# Altium schematic sheet Gamepad_IO.SchDoc
size A; SheetNumber: 2; SheetTotal: 4
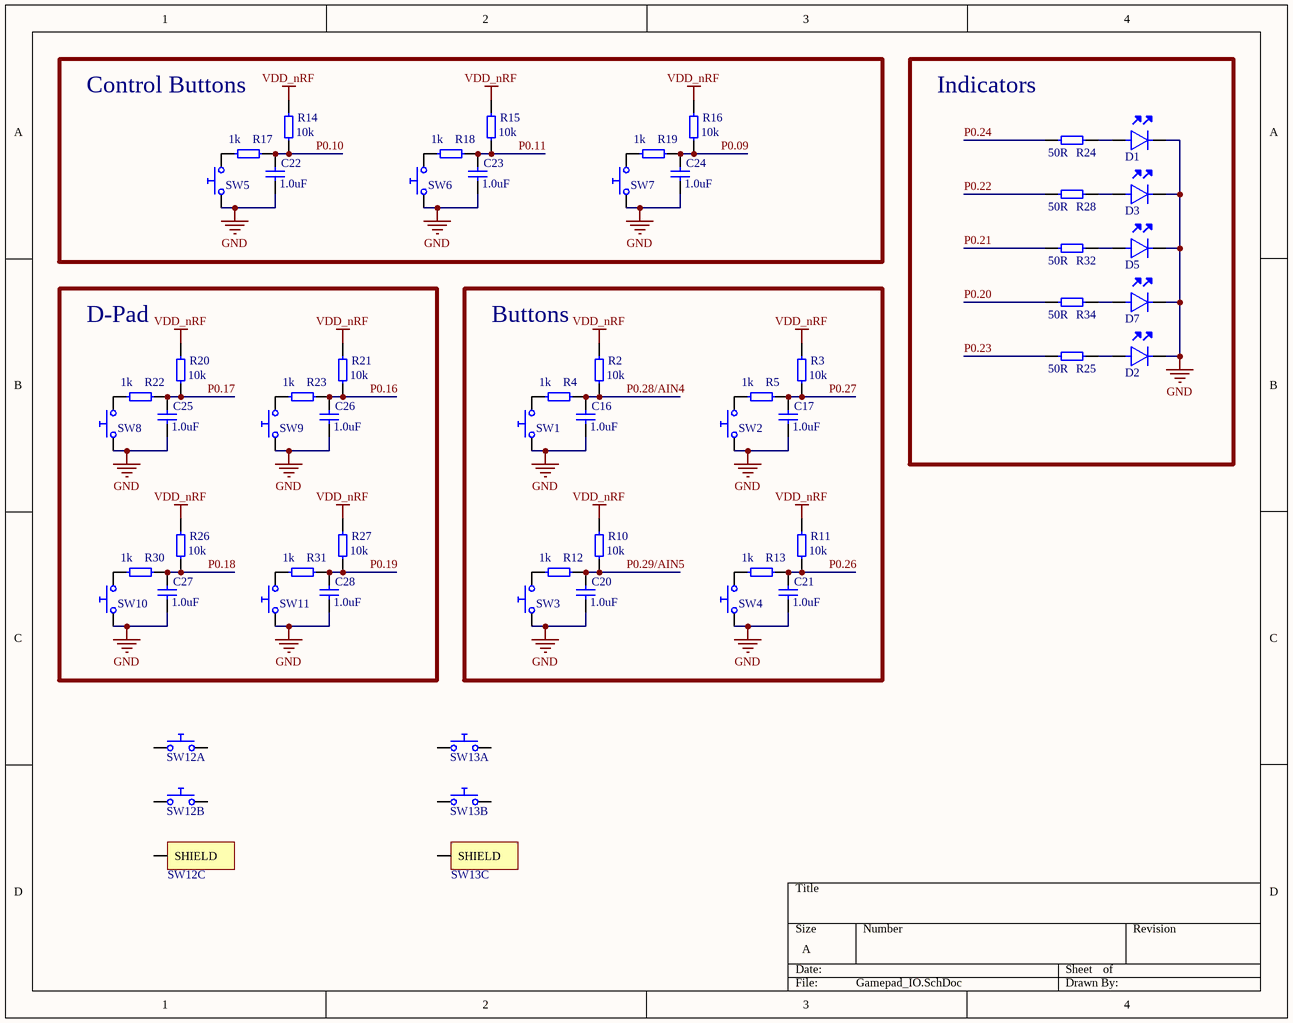
[diagram p0: Gamepad_IO.SchDoc]

## Parts
C16  1.0uF  [0603 Capacitor]
C17  1.0uF  [0603 Capacitor]
C20  1.0uF  [0603 Capacitor]
C21  1.0uF  [0603 Capacitor]
C22  1.0uF  [0603 Capacitor]
C23  1.0uF  [0603 Capacitor]
C24  1.0uF  [0603 Capacitor]
C25  1.0uF  [0603 Capacitor]
C26  1.0uF  [0603 Capacitor]
C27  1.0uF  [0603 Capacitor]
C28  1.0uF  [0603 Capacitor]
D1  LED  [0603 LED]  (value not drawn)
D2  LED  [0603 LED]  (value not drawn)
D3  LED  [0603 LED]  (value not drawn)
D5  LED  [0603 LED]  (value not drawn)
D7  LED  [0603 LED]  (value not drawn)
R2  10k  [0603 Resistor]
R3  10k  [0603 Resistor]
R4  1k  [0603 Resistor]
R5  1k  [0603 Resistor]
R10  10k  [0603 Resistor]
R11  10k  [0603 Resistor]
R12  1k  [0603 Resistor]
R13  1k  [0603 Resistor]
R14  10k  [0603 Resistor]
R15  10k  [0603 Resistor]
R16  10k  [0603 Resistor]
R17  1k  [0603 Resistor]
R18  1k  [0603 Resistor]
R19  1k  [0603 Resistor]
R20  10k  [0603 Resistor]
R21  10k  [0603 Resistor]
R22  1k  [0603 Resistor]
R23  1k  [0603 Resistor]
R24  50R  [0603 Resistor]
R25  50R  [0603 Resistor]
R26  10k  [0603 Resistor]
R27  10k  [0603 Resistor]
R28  50R  [0603 Resistor]
R30  1k  [0603 Resistor]
R31  1k  [0603 Resistor]
R32  50R  [0603 Resistor]
R34  50R  [0603 Resistor]
SW1  Switch Button  [ButtonPad Version 1]  (value not drawn)
SW2  Switch Button  [ButtonPad Version 1]  (value not drawn)
SW3  Switch Button  [ButtonPad Version 1]  (value not drawn)
SW4  Switch Button  [ButtonPad Version 1]  (value not drawn)
SW5  Switch Button  [ButtonPad Version 1]  (value not drawn)
SW6  Switch Button  [ButtonPad Version 1]  (value not drawn)
SW7  Switch Button  [ButtonPad Version 1]  (value not drawn)
SW8  Switch Button  [ButtonPad Version 1]  (value not drawn)
SW9  Switch Button  [ButtonPad Version 1]  (value not drawn)
SW10  Switch Button  [ButtonPad Version 1]  (value not drawn)
SW11  Switch Button  [ButtonPad Version 1]  (value not drawn)
SW12  TL2243  [TL2243]  (value not drawn)  (parts A,B,C of 3)
SW13  TL2243  [TL2243]  (value not drawn)  (parts A,B,C of 3)

## Blocks framed on the sheet
Control Buttons: C22-C24 R14-R19 SW5-SW7
Indicators: D1-D3 D5 D7 R24 R25 R28 R32 R34
D-Pad: C25-C28 R20-R23 R26 R27 R30 R31 SW8-SW11
Buttons: C16 C17 C20 C21 R2-R5 R10-R13 SW1-SW4

## Nets
GND: C16.1 C17.1 C20.1 C21.1 C22.1 C23.1 C24.1 C25.1 C26.1 C27.1 C28.1 D1.2 D2.2 D3.2 D5.2 D7.2 SW1.1 SW2.1 SW3.1 SW4.1 SW5.1 SW6.1 SW7.1 SW8.1 SW9.1 SW10.1 SW11.1
VDD_nRF: R2.2 R3.2 R10.2 R11.2 R14.2 R15.2 R16.2 R20.2 R21.2 R26.2 R27.2
P0.09: C24.2 R16.1 R19.2
P0.10: C22.2 R14.1 R17.2
P0.11: C23.2 R15.1 R18.2
P0.16: C26.2 R21.1 R23.2
P0.17: C25.2 R20.1 R22.2
P0.18: C27.2 R26.1 R30.2
P0.19: C28.2 R27.1 R31.2
P0.20: R34.1
P0.21: R32.1
P0.22: R28.1
P0.23: R25.1
P0.24: R24.1
P0.26: C21.2 R11.1 R13.2
P0.27: C17.2 R3.1 R5.2
P0.28/AIN4: C16.2 R2.1 R4.2
P0.29/AIN5: C20.2 R10.1 R12.2
NetD1_1: D1.1 R24.2
NetD2_1: D2.1 R25.2
NetD3_1: D3.1 R28.2
NetD5_1: D5.1 R32.2
NetD7_1: D7.1 R34.2
NetR4_1: R4.1 SW1.2
NetR5_1: R5.1 SW2.2
NetR12_1: R12.1 SW3.2
NetR13_1: R13.1 SW4.2
NetR17_1: R17.1 SW5.2
NetR18_1: R18.1 SW6.2
NetR19_1: R19.1 SW7.2
NetR22_1: R22.1 SW8.2
NetR23_1: R23.1 SW9.2
NetR30_1: R30.1 SW10.2
NetR31_1: R31.1 SW11.2

Not connected (* = marked no-connect by the designer): SW12 1 2 3 4 SHIELD; SW13 1 2 3 4 SHIELD

## Library data of the parts
C16 C17 C20-C28 = Capacitor
R2-R5 R10-R28 R30-R32 R34 = Resistor
SW12 SW13 = TL2243: SWITCH TACTILE SPSTX2 0.05A 12V; Manufacturer 1: E-Switch; Mechanical Life: 30000Cycles; Voltage Rating (DC): 100V; Throw Configuration: SPST; Contact Resistance: 100mR; Operating Force: 180gf; Current Rating: 50mA; Illumination Type: Non-Illuminated,Illuminated; Switch Travel: 0.25mm; Switch Function: Off-Mom; Actuator Length: 3.8mm; Supplier 1: Digi-Key; Supplier Part Number 1: EG4606-ND; Manufacturer Part Number 1: TL2243; RoHS: Yes; Category: Tactile Switches; Stock 1: 5183; Pricing 1: 1=0.69000, 10=0.66200, 25=0.63640, 100=0.55230, 250=0.50396, 500=0.46832, 1000=0.41996, 2500=0.39450, 5000=0.36651 (USD); Mount: Through Hole; Contact Material: Silver; Min Operating Temperature: -20°C; Max Operating Temperature: 70°C; Package Quantity: 600; Packaging: Bulk; Max Voltage Rating (DC): 12V; Termination: PC Pin; Electrical Life: 30000Cycles; Orientation: Right Angle; Series: TL2243; Size: 7.3mm; Lead Free: Lead Free; RoHS Compliant: Yes; ComponentLink1URL: https://datasheet.ciiva.com/2900/tl2243-2900969.pdf?src-supplier=Digi-Key; ComponentLink1Description: https://datasheet.ciiva.com/2900/tl2243-2900969.pdf?src-supplier=Digi-Key; ComponentLink2URL: https://datasheet.ciiva.com/13526/tl2243-26358-13526538.pdf?src-supplier=Mouser; ComponentLink2Description: https://datasheet.ciiva.com/13526/tl2243-26358-13526538.pdf?src-supplier=Mouser; ComponentLink3URL: https://datasheet.ciiva.com/31840/p010405-31840495.pdf?src-supplier=Onlinecomponents.com; ComponentLink3Description: https://datasheet.ciiva.com/31840/p010405-31840495.pdf?src-supplier=Onlinecomponents.com; ComponentLink4URL: https://datasheet.ciiva.com/16370/p010405m-16370087.pdf?src-supplier=Future+Electronics; ComponentLink4Description: https://datasheet.ciiva.com/16370/p010405m-16370087.pdf?src-supplier=Future+Electronics